# Altium project MB1936.PrjPcb (part 5 of 8)

## Sheet 2_DDR4_16bits.SchDoc: 2 DDR4 16 bits
size A3; Date: Not used; ApprovedBy: Not used; CheckedBy: Not used; Author: Not used; CompanyName: STMicroelectronics; DrawnBy: Not used; Engineer: Not used; Organization: Not used; Address1: Not used; Address2: Not used; Address3: Not used; Address4: Not used; DocumentNumber: Not used; Revision: Not used; SheetNumber: 6; SheetTotal: 18; CurrentTime: Not used; CurrentDate: Not used; Time: Not used; DocumentFullPathAndName: Not used; DocumentName: Not used; ModifiedDate: Not used; ImagePath: Not used; ProjectName: Not used; Application_BuildNumber: Not used
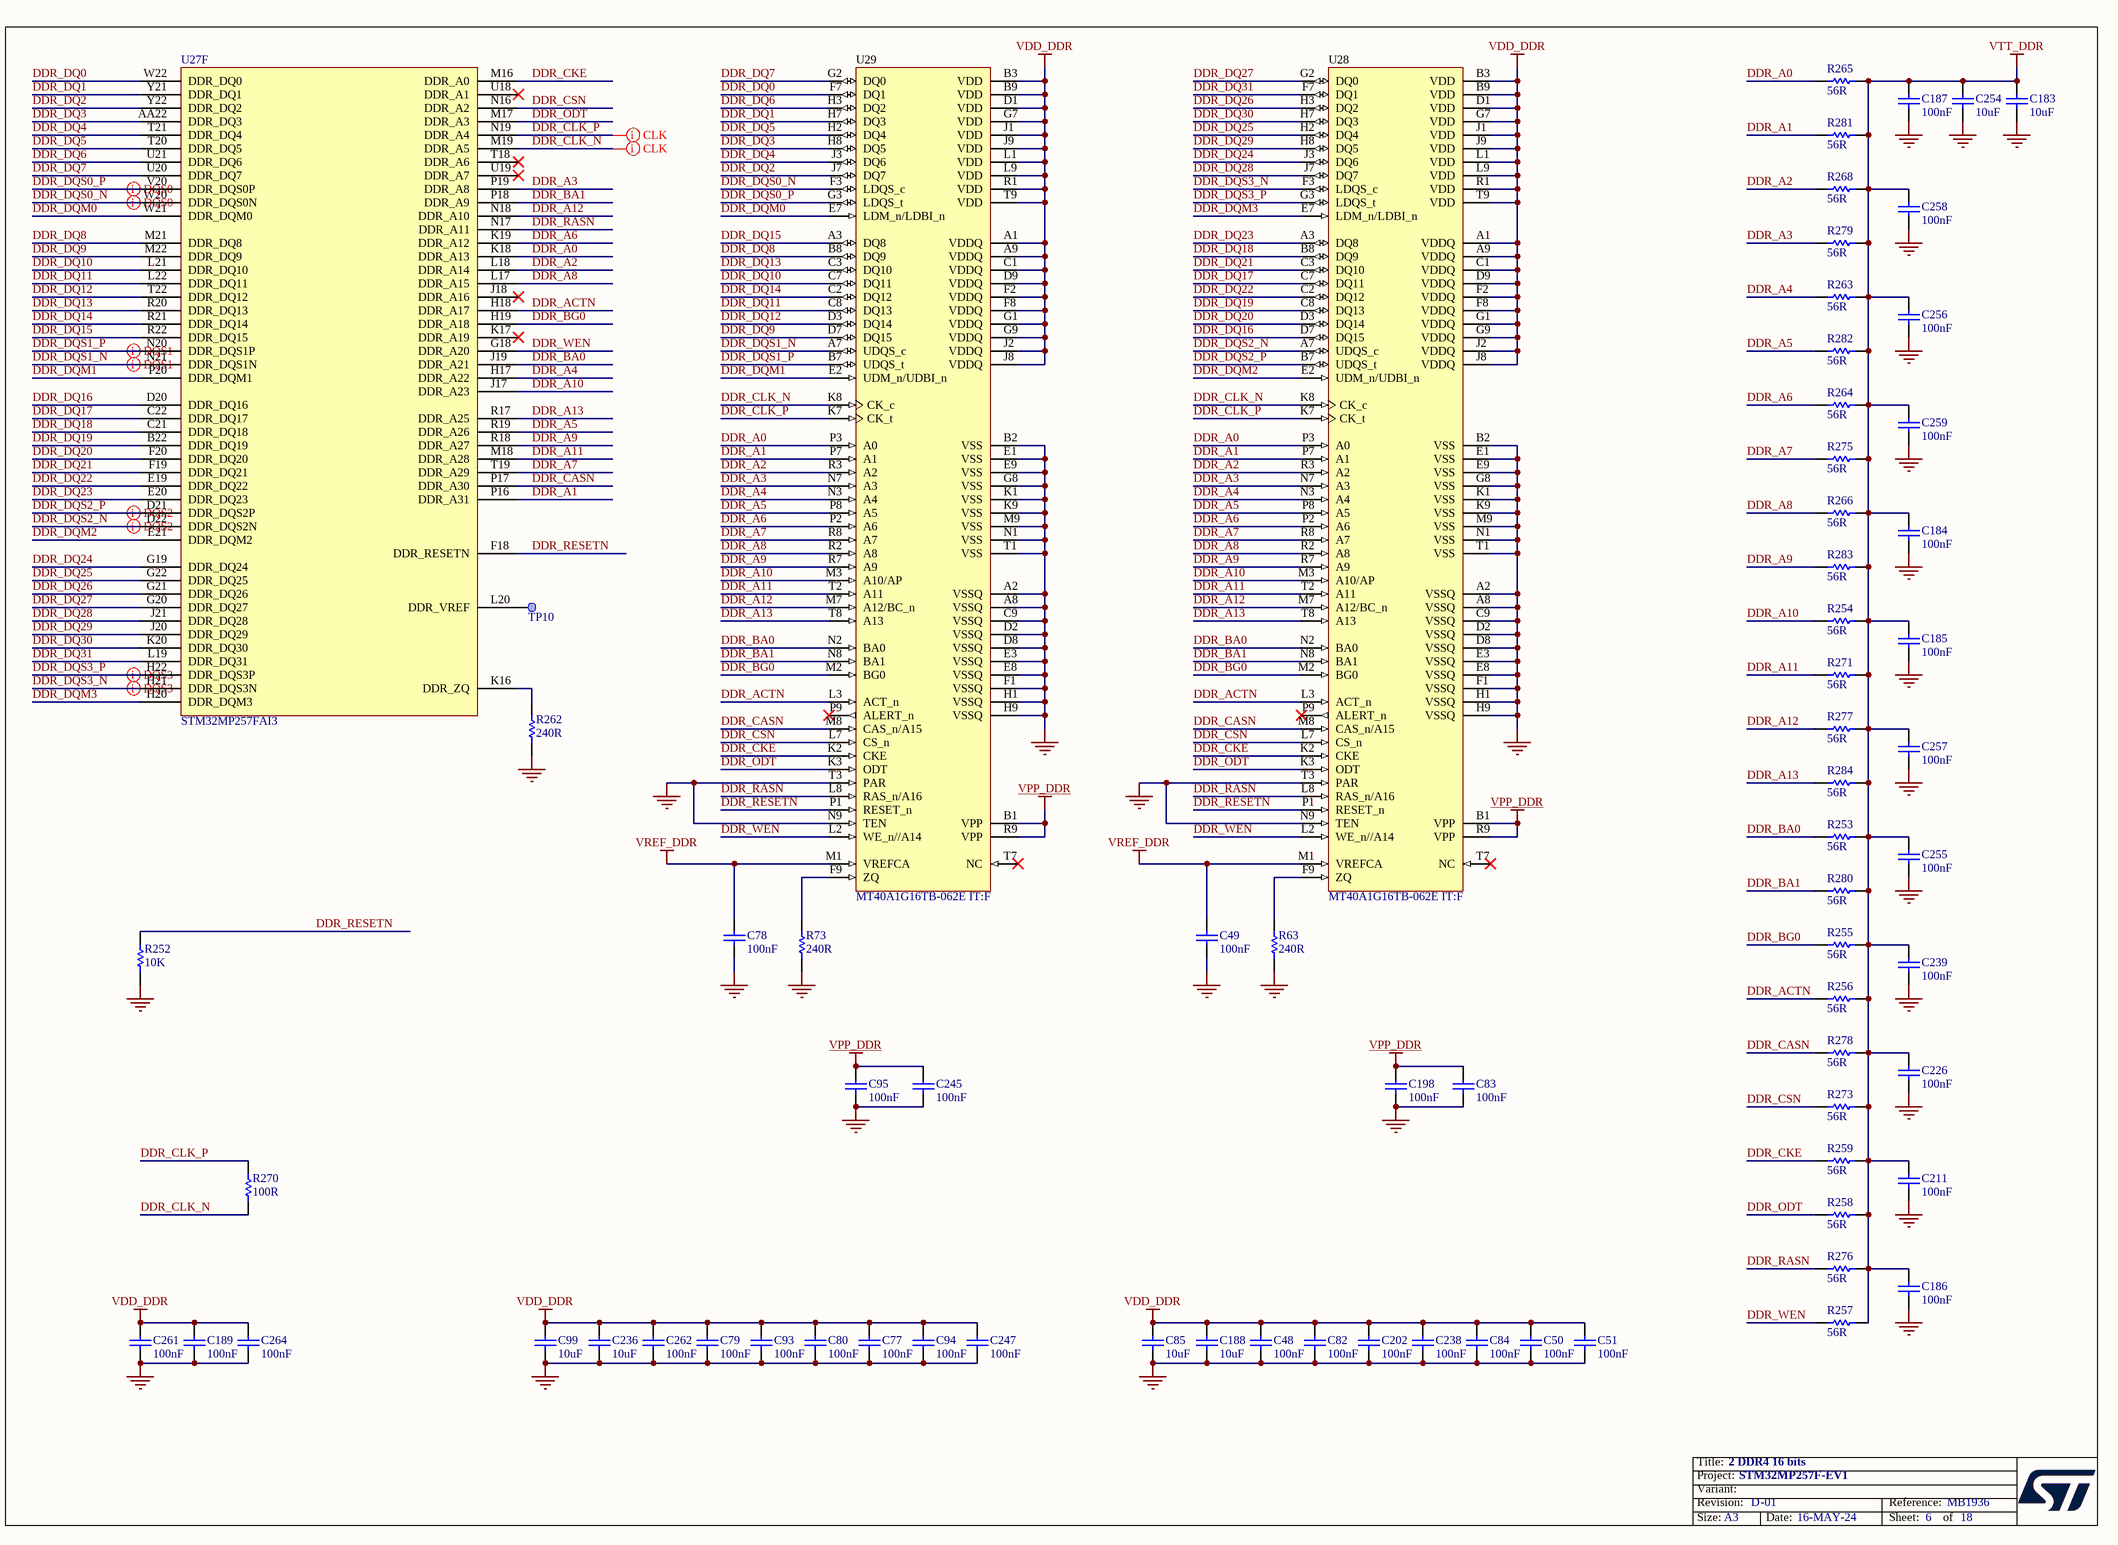
[diagram p13: 2_DDR4_16bits.SchDoc]

### Parts
C48  value 100nF  [C0402]  (hidden comment: Capacitor)
C49  value 100nF  [C0402]  (hidden comment: Capacitor)
C50  value 100nF  [C0402]  (hidden comment: Capacitor)
C51  value 100nF  [C0402]  (hidden comment: Capacitor)
C77  value 100nF  [C0402]  (hidden comment: Capacitor)
C78  value 100nF  [C0402]  (hidden comment: Capacitor)
C79  value 100nF  [C0402]  (hidden comment: Capacitor)
C80  value 100nF  [C0402]  (hidden comment: Capacitor)
C82  value 100nF  [C0402]  (hidden comment: Capacitor)
C83  value 100nF  [C0402]  (hidden comment: Capacitor)
C84  value 100nF  [C0402]  (hidden comment: Capacitor)
C85  value 10uF  [C0603]  (hidden comment: Capacitor)
C93  value 100nF  [C0402]  (hidden comment: Capacitor)
C94  value 100nF  [C0402]  (hidden comment: Capacitor)
C95  value 100nF  [C0402]  (hidden comment: Capacitor)
C99  value 10uF  [C0603]  (hidden comment: Capacitor)
C183  value 10uF  [C0603]  (hidden comment: Capacitor)
C184  value 100nF  [C0402]  (hidden comment: Capacitor)
C185  value 100nF  [C0402]  (hidden comment: Capacitor)
C186  value 100nF  [C0402]  (hidden comment: Capacitor)
C187  value 100nF  [C0402]  (hidden comment: Capacitor)
C188  value 10uF  [C0603]  (hidden comment: Capacitor)
C189  value 100nF  [C0402]  (hidden comment: Capacitor)
C198  value 100nF  [C0402]  (hidden comment: Capacitor)
C202  value 100nF  [C0402]  (hidden comment: Capacitor)
C211  value 100nF  [C0402]  (hidden comment: Capacitor)
C226  value 100nF  [C0402]  (hidden comment: Capacitor)
C236  value 10uF  [C0603]  (hidden comment: Capacitor)
C238  value 100nF  [C0402]  (hidden comment: Capacitor)
C239  value 100nF  [C0402]  (hidden comment: Capacitor)
C245  value 100nF  [C0402]  (hidden comment: Capacitor)
C247  value 100nF  [C0402]  (hidden comment: Capacitor)
C254  value 10uF  [C0603]  (hidden comment: Capacitor)
C255  value 100nF  [C0402]  (hidden comment: Capacitor)
C256  value 100nF  [C0402]  (hidden comment: Capacitor)
C257  value 100nF  [C0402]  (hidden comment: Capacitor)
C258  value 100nF  [C0402]  (hidden comment: Capacitor)
C259  value 100nF  [C0402]  (hidden comment: Capacitor)
C261  value 100nF  [C0402]  (hidden comment: Capacitor)
C262  value 100nF  [C0402]  (hidden comment: Capacitor)
C264  value 100nF  [C0402]  (hidden comment: Capacitor)
R63  value 240R  [R0201_H0P23]  (hidden comment: Resistor)
R73  value 240R  [R0201_H0P23]  (hidden comment: Resistor)
R252  value 10K  [R0402]  (hidden comment: Resistor)
R253  value 56R  [R0402]  (hidden comment: Resistor)
R254  value 56R  [R0402]  (hidden comment: Resistor)
R255  value 56R  [R0402]  (hidden comment: Resistor)
R256  value 56R  [R0402]  (hidden comment: Resistor)
R257  value 56R  [R0402]  (hidden comment: Resistor)
R258  value 56R  [R0402]  (hidden comment: Resistor)
R259  value 56R  [R0402]  (hidden comment: Resistor)
R262  value 240R  [R0201_H0P23]  (hidden comment: Resistor)
R263  value 56R  [R0402]  (hidden comment: Resistor)
R264  value 56R  [R0402]  (hidden comment: Resistor)
R265  value 56R  [R0402]  (hidden comment: Resistor)
R266  value 56R  [R0402]  (hidden comment: Resistor)
R268  value 56R  [R0402]  (hidden comment: Resistor)
R270  value 100R  [R0402]  (hidden comment: Resistor)
R271  value 56R  [R0402]  (hidden comment: Resistor)
R273  value 56R  [R0402]  (hidden comment: Resistor)
R275  value 56R  [R0402]  (hidden comment: Resistor)
R276  value 56R  [R0402]  (hidden comment: Resistor)
R277  value 56R  [R0402]  (hidden comment: Resistor)
R278  value 56R  [R0402]  (hidden comment: Resistor)
R279  value 56R  [R0402]  (hidden comment: Resistor)
R280  value 56R  [R0402]  (hidden comment: Resistor)
R281  value 56R  [R0402]  (hidden comment: Resistor)
R282  value 56R  [R0402]  (hidden comment: Resistor)
R283  value 56R  [R0402]  (hidden comment: Resistor)
R284  value 56R  [R0402]  (hidden comment: Resistor)
TP10  Test Point  [TP_SMD_0-6MM]  (value not drawn)  (no BOM)
U27  STM32MP257FAI3  [ICC_LFBGA436_18X18_P080_H1P70_STM32MP257_CODE-B0D1]  (part F of 9)
U28  MT40A1G16TB-062E IT:F  [ICC_FBGA96_TB_7P5X13_P080]
U29  MT40A1G16TB-062E IT:F  [ICC_FBGA96_TB_7P5X13_P080]

### Nets
GND: C48.1 C49.1 C50.1 C51.1 C77.1 C78.1 C79.1 C80.1 C82.1 C83.1 C84.1 C85.1 C93.1 C94.1 C95.1 C99.1 C183.1 C184.1 C185.1 C186.1 C187.1 C188.1 C189.1 C198.1 C202.1 C211.1 C226.1 C236.1 C238.1 C239.1 C245.1 C247.1 C254.1 C255.1 C256.1 C257.1 C258.1 C259.1 C261.1 C262.1 C264.1 R63.1 R73.1 R252.1 R262.1 U28.A2(VSSQ) U28.A8(VSSQ) U28.B2(VSS) U28.C9(VSSQ) U28.D2(VSSQ) U28.D8(VSSQ) U28.E1(VSS) U28.E3(VSSQ) U28.E8(VSSQ) U28.E9(VSS) U28.F1(VSSQ) U28.G8(VSS) U28.H1(VSSQ) U28.H9(VSSQ) U28.K1(VSS) U28.K9(VSS) U28.M9(VSS) U28.N1(VSS) U28.N9(TEN) U28.T1(VSS) U28.T3(PAR) U29.A2(VSSQ) U29.A8(VSSQ) U29.B2(VSS) U29.C9(VSSQ) U29.D2(VSSQ) U29.D8(VSSQ) U29.E1(VSS) U29.E3(VSSQ) U29.E8(VSSQ) U29.E9(VSS) U29.F1(VSSQ) U29.G8(VSS) U29.H1(VSSQ) U29.H9(VSSQ) U29.K1(VSS) U29.K9(VSS) U29.M9(VSS) U29.N1(VSS) U29.N9(TEN) U29.T1(VSS) U29.T3(PAR)
VDD_DDR: C48.2 C50.2 C51.2 C77.2 C79.2 C80.2 C82.2 C84.2 C85.2 C93.2 C94.2 C99.2 C188.2 C189.2 C202.2 C236.2 C238.2 C247.2 C261.2 C262.2 C264.2 U28.A1(VDDQ) U28.A9(VDDQ) U28.B3(VDD) U28.B9(VDD) U28.C1(VDDQ) U28.D1(VDD) U28.D9(VDDQ) U28.F2(VDDQ) U28.F8(VDDQ) U28.G1(VDDQ) U28.G7(VDD) U28.G9(VDDQ) U28.J1(VDD) U28.J2(VDDQ) U28.J8(VDDQ) U28.J9(VDD) U28.L1(VDD) U28.L9(VDD) U28.R1(VDD) U28.T9(VDD) U29.A1(VDDQ) U29.A9(VDDQ) U29.B3(VDD) U29.B9(VDD) U29.C1(VDDQ) U29.D1(VDD) U29.D9(VDDQ) U29.F2(VDDQ) U29.F8(VDDQ) U29.G1(VDDQ) U29.G7(VDD) U29.G9(VDDQ) U29.J1(VDD) U29.J2(VDDQ) U29.J8(VDDQ) U29.J9(VDD) U29.L1(VDD) U29.L9(VDD) U29.R1(VDD) U29.T9(VDD)
VPP_DDR: C83.2 C95.2 C198.2 C245.2 U28.B1(VPP) U28.R9(VPP) U29.B1(VPP) U29.R9(VPP)
VREF_DDR: C49.2 C78.2 U28.M1(VREFCA) U29.M1(VREFCA)
VTT_DDR: C183.2 C184.2 C185.2 C186.2 C187.2 C211.2 C226.2 C239.2 C254.2 C255.2 C256.2 C257.2 C258.2 C259.2 R253.2 R254.2 R255.2 R256.2 R257.2 R258.2 R259.2 R263.2 R264.2 R265.2 R266.2 R268.2 R271.2 R273.2 R275.2 R276.2 R277.2 R278.2 R279.2 R280.2 R281.2 R282.2 R283.2 R284.2
DDR_A0: R265.1 U27.K18(DDR_A13) U28.P3(A0) U29.P3(A0)
DDR_A1: R281.1 U27.P16(DDR_A31) U28.P7(A1) U29.P7(A1)
DDR_A2: R268.1 U27.L18(DDR_A14) U28.R3(A2) U29.R3(A2)
DDR_A3: R279.1 U27.P19(DDR_A8) U28.N7(A3) U29.N7(A3)
DDR_A4: R263.1 U27.H17(DDR_A22) U28.N3(A4) U29.N3(A4)
DDR_A5: R282.1 U27.R19(DDR_A26) U28.P8(A5) U29.P8(A5)
DDR_A6: R264.1 U27.K19(DDR_A12) U28.P2(A6) U29.P2(A6)
DDR_A7: R275.1 U27.T19(DDR_A29) U28.R8(A7) U29.R8(A7)
DDR_A8: R266.1 U27.L17(DDR_A15) U28.R2(A8) U29.R2(A8)
DDR_A9: R283.1 U27.R18(DDR_A27) U28.R7(A9) U29.R7(A9)
DDR_A10: R254.1 U27.J17(DDR_A23) U28.M3(A10/AP) U29.M3(A10/AP)
DDR_A11: R271.1 U27.M18(DDR_A28) U28.T2(A11) U29.T2(A11)
DDR_A12: R277.1 U27.N18(DDR_A10) U28.M7(A12/BC_n) U29.M7(A12/BC_n)
DDR_A13: R284.1 U27.R17(DDR_A25) U28.T8(A13) U29.T8(A13)
DDR_ACTN: R256.1 U27.H18(DDR_A17) U28.L3(ACT_n) U29.L3(ACT_n)
DDR_BA0: R253.1 U27.J19(DDR_A21) U28.N2(BA0) U29.N2(BA0)
DDR_BA1: R280.1 U27.P18(DDR_A9) U28.N8(BA1) U29.N8(BA1)
DDR_BG0: R255.1 U27.H19(DDR_A18) U28.M2(BG0) U29.M2(BG0)
DDR_CASN: R278.1 U27.P17(DDR_A30) U28.M8(CAS_n/A15) U29.M8(CAS_n/A15)
DDR_CKE: R259.1 U27.M16(DDR_A0) U28.K2(CKE) U29.K2(CKE)
DDR_CLK_N: R270.2 U27.M19(DDR_A5) U28.K8(CK_c) U29.K8(CK_c)
DDR_CLK_P: R270.1 U27.N19(DDR_A4) U28.K7(CK_t) U29.K7(CK_t)
DDR_CSN: R273.1 U27.N16(DDR_A2) U28.L7(CS_n) U29.L7(CS_n)
DDR_DQ0: U27.W22(DDR_DQ0) U29.F7(DQ1)
DDR_DQ1: U27.Y21(DDR_DQ1) U29.H7(DQ3)
DDR_DQ2: U27.Y22(DDR_DQ2) U29.J7(DQ7)
DDR_DQ3: U27.AA22(DDR_DQ3) U29.H8(DQ5)
DDR_DQ4: U27.T21(DDR_DQ4) U29.J3(DQ6)
DDR_DQ5: U27.T20(DDR_DQ5) U29.H2(DQ4)
DDR_DQ6: U27.U21(DDR_DQ6) U29.H3(DQ2)
DDR_DQ7: U27.U20(DDR_DQ7) U29.G2(DQ0)
DDR_DQ8: U27.M21(DDR_DQ8) U29.B8(DQ9)
DDR_DQ9: U27.M22(DDR_DQ9) U29.D7(DQ15)
DDR_DQ10: U27.L21(DDR_DQ10) U29.C7(DQ11)
DDR_DQ11: U27.L22(DDR_DQ11) U29.C8(DQ13)
DDR_DQ12: U27.T22(DDR_DQ12) U29.D3(DQ14)
DDR_DQ13: U27.R20(DDR_DQ13) U29.C3(DQ10)
DDR_DQ14: U27.R21(DDR_DQ14) U29.C2(DQ12)
DDR_DQ15: U27.R22(DDR_DQ15) U29.A3(DQ8)
DDR_DQ16: U27.D20(DDR_DQ16) U28.D7(DQ15)
DDR_DQ17: U27.C22(DDR_DQ17) U28.C7(DQ11)
DDR_DQ18: U27.C21(DDR_DQ18) U28.B8(DQ9)
DDR_DQ19: U27.B22(DDR_DQ19) U28.C8(DQ13)
DDR_DQ20: U27.F20(DDR_DQ20) U28.D3(DQ14)
DDR_DQ21: U27.F19(DDR_DQ21) U28.C3(DQ10)
DDR_DQ22: U27.E19(DDR_DQ22) U28.C2(DQ12)
DDR_DQ23: U27.E20(DDR_DQ23) U28.A3(DQ8)
DDR_DQ24: U27.G19(DDR_DQ24) U28.J3(DQ6)
DDR_DQ25: U27.G22(DDR_DQ25) U28.H2(DQ4)
DDR_DQ26: U27.G21(DDR_DQ26) U28.H3(DQ2)
DDR_DQ27: U27.G20(DDR_DQ27) U28.G2(DQ0)
DDR_DQ28: U27.J21(DDR_DQ28) U28.J7(DQ7)
DDR_DQ29: U27.J20(DDR_DQ29) U28.H8(DQ5)
DDR_DQ30: U27.K20(DDR_DQ30) U28.H7(DQ3)
DDR_DQ31: U27.L19(DDR_DQ31) U28.F7(DQ1)
DDR_DQM0: U27.W21(DDR_DQM0) U29.E7(LDM_n/LDBI_n)
DDR_DQM1: U27.P20(DDR_DQM1) U29.E2(UDM_n/UDBI_n)
DDR_DQM2: U27.E21(DDR_DQM2) U28.E2(UDM_n/UDBI_n)
DDR_DQM3: U27.H20(DDR_DQM3) U28.E7(LDM_n/LDBI_n)
DDR_DQS0_N: U27.W20(DDR_DQS0N) U29.F3(LDQS_c)
DDR_DQS0_P: U27.V20(DDR_DQS0P) U29.G3(LDQS_t)
DDR_DQS1_N: U27.N21(DDR_DQS1N) U29.A7(UDQS_c)
DDR_DQS1_P: U27.N20(DDR_DQS1P) U29.B7(UDQS_t)
DDR_DQS2_N: U27.D22(DDR_DQS2N) U28.A7(UDQS_c)
DDR_DQS2_P: U27.D21(DDR_DQS2P) U28.B7(UDQS_t)
DDR_DQS3_N: U27.H21(DDR_DQS3N) U28.F3(LDQS_c)
DDR_DQS3_P: U27.H22(DDR_DQS3P) U28.G3(LDQS_t)
DDR_ODT: R258.1 U27.M17(DDR_A3) U28.K3(ODT) U29.K3(ODT)
DDR_RASN: R276.1 U27.N17(DDR_A11) U28.L8(RAS_n/A16) U29.L8(RAS_n/A16)
DDR_RESETN: R252.2 U27.F18(DDR_RESETN) U28.P1(RESET_n) U29.P1(RESET_n)
DDR_WEN: R257.1 U27.G18(DDR_A20) U28.L2(WE_n//A14) U29.L2(WE_n//A14)
NetR63_2: R63.2 U28.F9(ZQ)
NetR73_2: R73.2 U29.F9(ZQ)
NetR262_2: R262.2 U27.K16(DDR_ZQ)
NetTP10_1: TP10.1 U27.L20(DDR_VREF)

Not connected (* = marked no-connect by the designer): U27 J18(DDR_A16)* K17(DDR_A19)* T18(DDR_A6)* U18(DDR_A1)* U19(DDR_A7)*; U28 P9(ALERT_n)* T7(NC)*; U29 P9(ALERT_n)* T7(NC)*

### Layout directives
differential pair: DDR_CLK_N, DDR_CLK_P, DDR_DQS0_N, DDR_DQS0_P, DDR_DQS1_N, DDR_DQS1_P, DDR_DQS2_N, DDR_DQS2_P, DDR_DQS3_N, DDR_DQS3_P

### Notes on the sheet
- Title:
- Project:
- Size:
- Revision:
- Variant:
- A3
- -
- Date:
- Reference:
- Sheet:
- of

### Library data of the parts
C48-C51 C77-C80 C82-C84 C93-C95 C184-C187 C189 C198 C202 C211 C226 C238 C239 C245 C247 C255-C259 C261 C262 C264 = MCD-00006: Capacitor, MLCC, 100nF, 16V, X7R, +/-10%, 0402, T=0.5mm; Part_Preference: Recommended; Manufacturer: YAGEO; Manufacturer_Part_Number: CC0402KRX7R7BB104; Alternate_Manufacturer: MURATA; Alternate_Manufacturer_Part_Number: GCM155R71C104KA55D; Order_Code_RS: 616-9701; Internal_Part_Number: MCD-00006; Status: Released; Part_Type: Capacitor; Package: 0402; ComponentLink1Description: Datasheet; ComponentLink1URL: http://tunmcdsvn.tun.st.com/Component_Documentation_Library/Trunk/Capacitor/YAGEO_X7R_Series; Order_Code_Digikey: 311-1338-1-ND; Order_Code_Farnell: 9402047
C85 C99 C188 C236 = MCD-01341: Capacitor, MLCC, 10uF, 6V3, X5R, +/-20%, 0603, T=0,8mm; Part_Preference: Recommended; Manufacturer: MURATA; Manufacturer_Part_Number: GRM188R60J106ME47D; Alternate_Manufacturer_Part_Number: GRM188R60J106ME84D; Internal_Part_Number: MCD-01341; Status: Released; Part_Type: Capacitor; Alternate_Manufacturer: MURATA; Package: 0603; ComponentLink1URL: http://tunmcdsvn.tun.st.com/Component_Documentation_Library/Trunk/Capacitor/MURATA_GRM_Series; Order_Code_Digikey: 490-3896-1-ND; Order_Code_Farnell: 1735528; Order_Code_RS: N/A
C183 C254 = MCD-00099: Capacitor, MLCC, 10uF, 10V, X5R, +/-10%, 0603, T=0.8mm; Part_Preference: Recommended; Manufacturer: MURATA; Manufacturer_Part_Number: GRM188R61A106KE69D; Partial_Alternate_Internal_Part_Number: MCD-03152; Order_Code_RS: 2494233; Component_Country_Of_Origin: Japan°°; ShowFields: YES; ID: 2770; Internal_Part_Number: MCD-00099; Status: Released; Part_Type: Capacitor; Package: 0603; ComponentLink1URL: http://tunmcdsvn.tun.st.com/Component_Documentation_Library/Trunk/Capacitor/MURATA_GRM_Series; Order_Code_Digikey: 490-10474-1-ND; Order_Code_Farnell: 2494233
R63 R73 R262 = MCD-02253: Resistor,240R,0201,1%,1/20W; Part_Preference: Recommended; Manufacturer: YAGEO; Manufacturer_Part_Number: RC0201FR-07240RL; Internal_Part_Number: MCD-02253; Status: Checked; Part_Type: Resistor; Alternate_Manufacturer: N/A; Alternate_Manufacturer_Part_Number: N/A; Package: R0201; ComponentLink1URL: http://tunmcdsvn.tun.st.com/Component_Datasheet_Library/Trunk/Resistors/Yageo_Resistor_RC0201-series; Order_Code_Digikey: YAG2528CT-ND; Order_Code_Farnell: N/A; Order_Code_RS: N/A
R252 = MCD-00053: Resistor,10K,0402,1%,1/16W; BMS_Part_Number: 9131590; Part_Preference: Recommended; Manufacturer: YAGEO; Manufacturer_Part_Number: RC0402FR-0710KL; Internal_Part_Number: MCD-00053; Status: Released; Part_Type: Resistor; Package: 0402; ComponentLink1Description: Datasheet; ComponentLink1URL: http://tunmcdsvn.tun.st.com/Component_Documentation_Library/Trunk/Resistor/YAGEO_RC_L_Series; Order_Code_Digikey: 311-10.0KLRCT-ND; Order_Code_Farnell: 9239359; Order_Code_RS: N/A; Alternate_Manufacturer: N/A; Alternate_Manufacturer_Part_Number: N/A
R253-R259 R263-R266 R268 R271 R273 R275-R284 = MCD-00054: Resistor, 56R, 0402, +/-1%, 1/16W; Part_Preference: Recommended; Manufacturer: YAGEO; Manufacturer_Part_Number: RC0402FR-0756RL; Internal_Part_Number: MCD-00054; Status: Released; Part_Type: Resistor; Package: 0402; ComponentLink1URL: http://tunmcdsvn.tun.st.com/Component_Documentation_Library/Trunk/Resistor/YAGEO_RC_L_Series; Order_Code_Digikey: 311-56.0LRCT-ND; Order_Code_Farnell: 9239081; Order_Code_RS: N/A; Alternate_Manufacturer: N/A; Alternate_Manufacturer_Part_Number: N/A
R270 = MCD-01819: Resistor,100R,0402,0,5%,1/16W,±100ppm/°C; Part_Preference: Recommended; Manufacturer: YAGEO; Manufacturer_Part_Number: RC0402DR-07100RL; Internal_Part_Number: MCD-01819; Status: Released; Part_Type: Resistor; Package: 0402; ComponentLink1Description: Datasheet; ComponentLink1URL: http://tunmcdsvn.tun.st.com/Component_Documentation_Library/Trunk/Resistor/YAGEO_RC_L_Series; Order_Code_Digikey: RC0402DR-07100RL-ND; Order_Code_Farnell: N/A; Order_Code_RS: N/A; Alternate_Manufacturer: N/A; Alternate_Manufacturer_Part_Number: N/A
TP10 = MCD-00631: Test Point 0.6mm; Part_Type: Misc; Part_Preference: Recommended; Internal_Part_Number: MCD-00631; Status: Released; Manufacturer: N/A; Manufacturer_Part_Number: N/A
U27 = MCD-02000: as U27 on sheet Power_MPU; Internal_Part_Number: MCD-02000; Value: STM32MP257FAI3; Status: Checked; Manufacturer_Part_Number: STM32MP257FAI3; Package: LFBGA-436; ComponentLink1URL: http://tunmcdsvn.tun.st.com/Component_Documentation_Library/Trunk/IC/STMICROELECTRONICS_STM32MP257FAI3; Order_Code_Digikey: N/A; Order_Code_Farnell: N/A; Order_Code_RS: N/A
U28 U29 = MCD-03523: Memory, DDR4 SDRAM, 1V2, 16Gbit, FBGA96; Part_Type: IC; Part_Preference: Recommended; Manufacturer: MICRON; Component_Country_Of_Origin: Taiwan°; ShowFields: YES; ID: 5639; Internal_Part_Number: MCD-03523; Value: MT40A1G16TB-062E IT:F; Status: New; Manufacturer_Part_Number: MT40A1G16TB-062E IT:F; Package: FBGA-96; ComponentLink1URL: http://tunmcdsvn.tun.st.com/Component_Documentation_Library/Trunk/IC/MICRON_MT40A1G16TB-062E-IT-F; Order_Code_Digikey: N/A; Order_Code_Farnell: N/A; Order_Code_RS: N/A

## Sheet USB_PCIe.SchDoc: USB_PCIe
size A3; Date: Not used; ApprovedBy: Not used; CheckedBy: Not used; Author: Not used; CompanyName: STMicroelectronics; DrawnBy: Not used; Engineer: Not used; Organization: Not used; Address1: Not used; Address2: Not used; Address3: Not used; Address4: Not used; DocumentNumber: Not used; Revision: Not used; SheetNumber: 11; SheetTotal: 18; CurrentTime: Not used; CurrentDate: Not used; Time: Not used; DocumentFullPathAndName: Not used; DocumentName: Not used; ModifiedDate: Not used; ImagePath: Not used; ProjectName: Not used; Application_BuildNumber: Not used
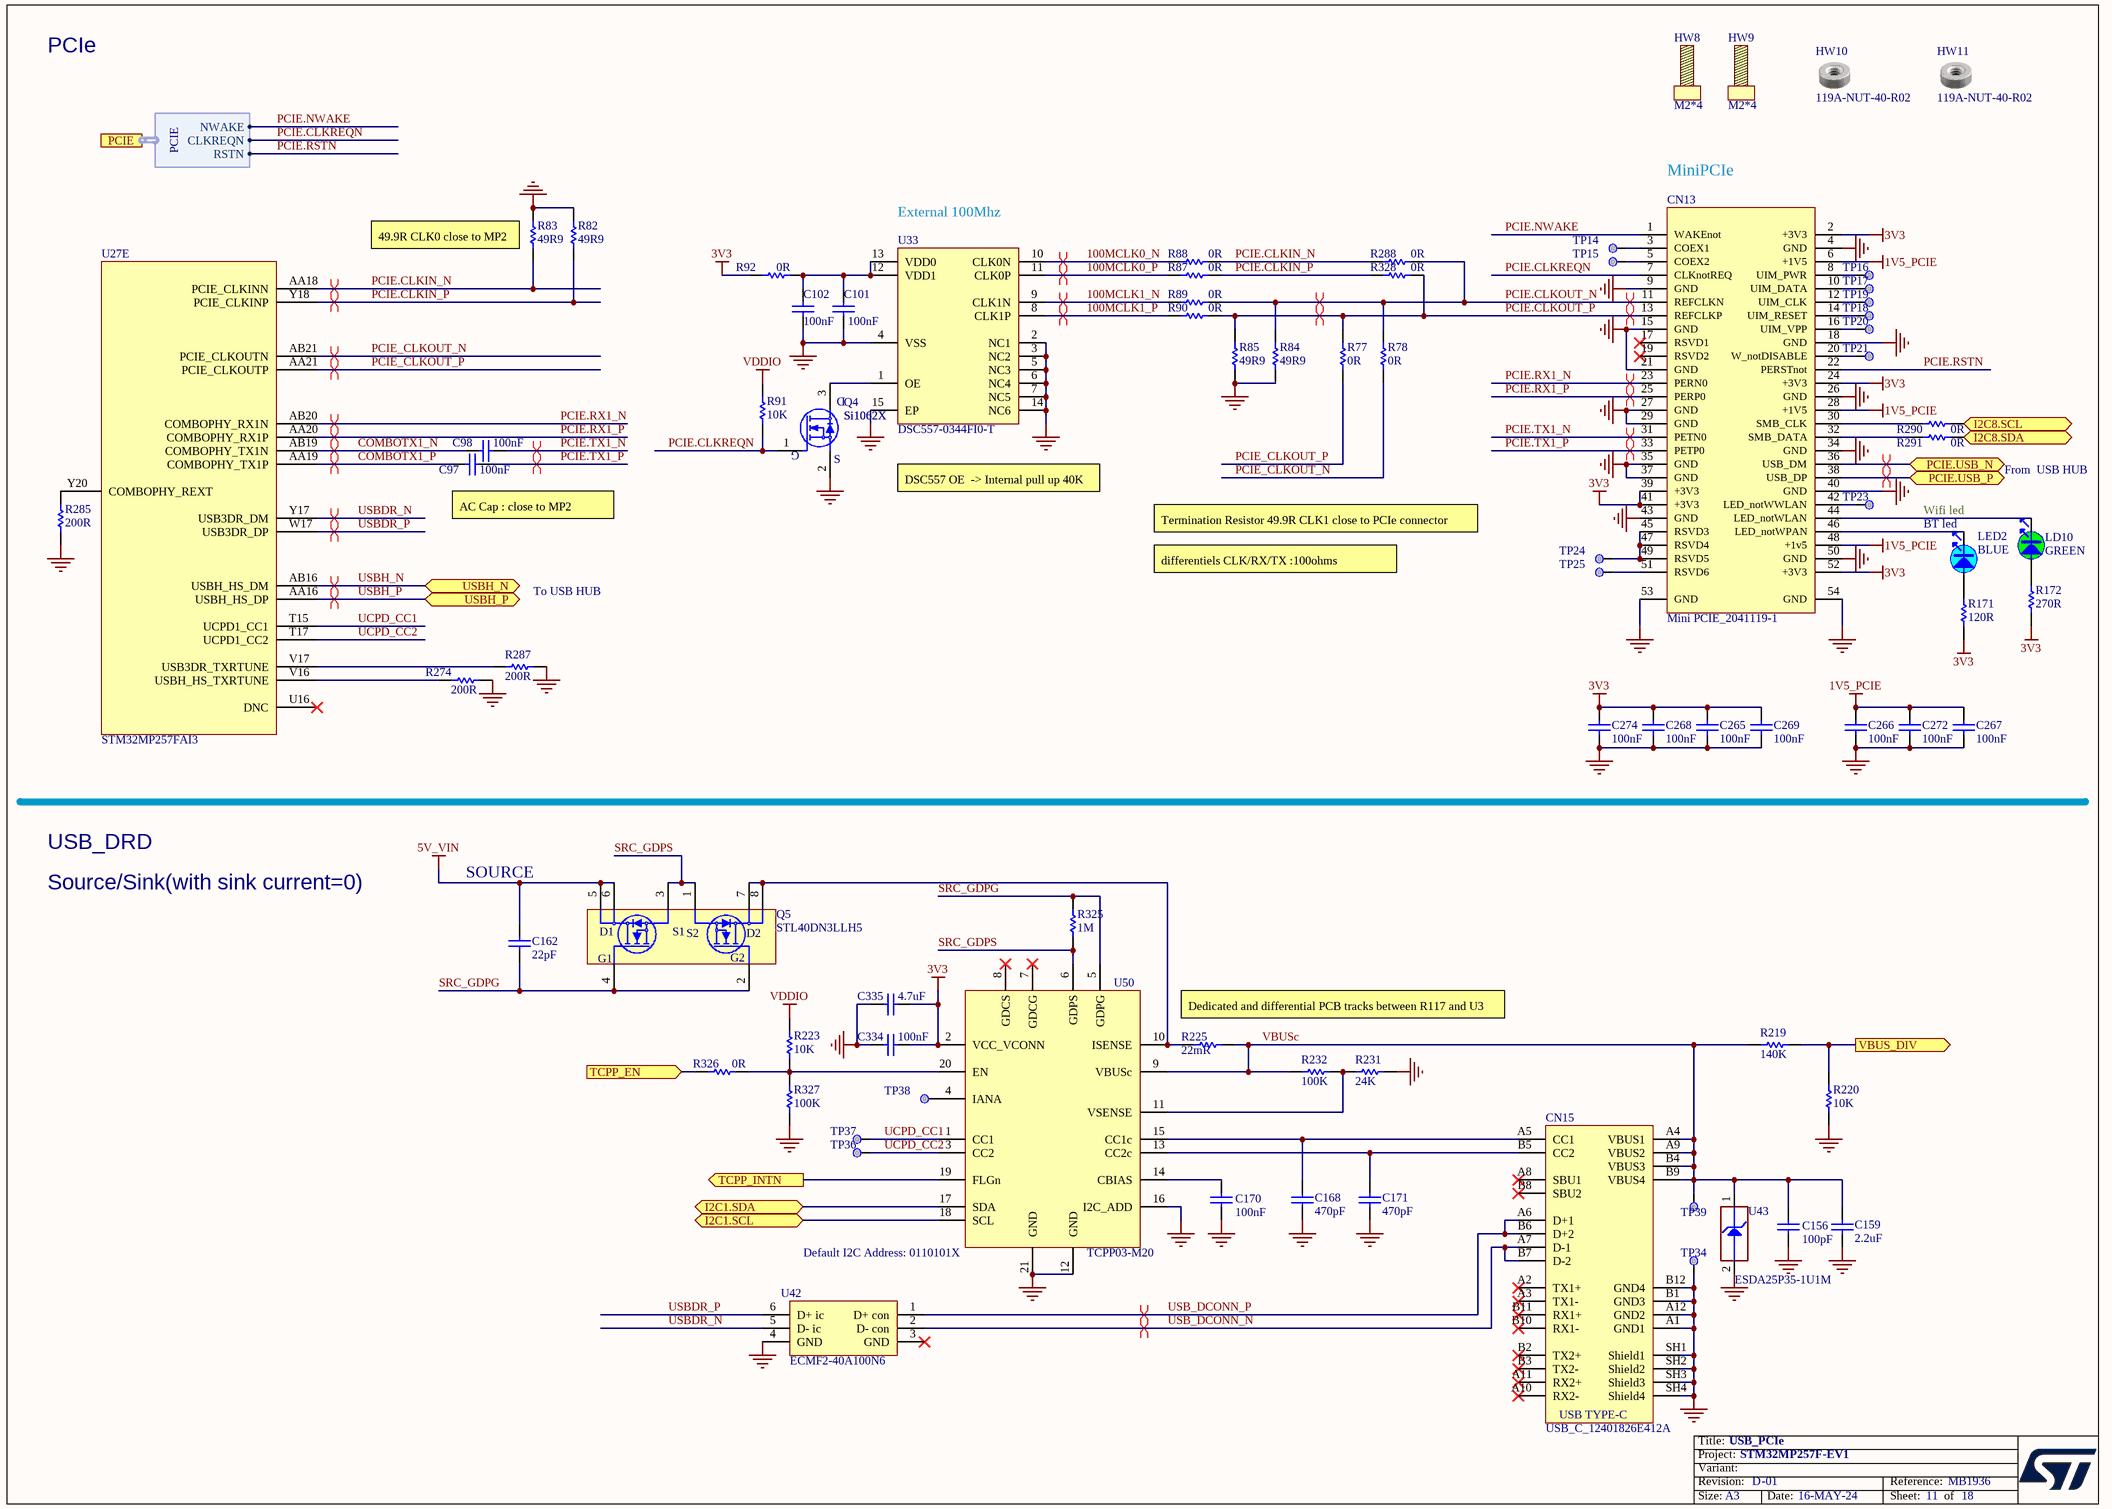
[diagram p14: USB_PCIe.SchDoc]

### Parts
C97  value 100nF  [C0201_MURATA_GRM033_H0P3]  (hidden comment: Capacitor)
C98  value 100nF  [C0201_MURATA_GRM033_H0P3]  (hidden comment: Capacitor)
C101  value 100nF  [C0402]  (hidden comment: Capacitor)
C102  value 100nF  [C0402]  (hidden comment: Capacitor)
C156  value 100pF  [C0402]  (hidden comment: Capacitor)
C159  value 2.2uF  [C0805]  (hidden comment: Capacitor)
C162  value 22pF  [C0402]  (hidden comment: Capacitor)
C168  value 470pF  [C0402]  (hidden comment: Capacitor)
C170  value 100nF  [C0603]  (hidden comment: Capacitor)
C171  value 470pF  [C0402]  (hidden comment: Capacitor)
C265  value 100nF  [C0201_H0P3]  (hidden comment: Capacitor)
C266  value 100nF  [C0201_H0P3]  (hidden comment: Capacitor)
C267  value 100nF  [C0201_H0P3]  (hidden comment: Capacitor)
C268  value 100nF  [C0201_H0P3]  (hidden comment: Capacitor)
C269  value 100nF  [C0201_H0P3]  (hidden comment: Capacitor)
C272  value 100nF  [C0201_H0P3]  (hidden comment: Capacitor)
C274  value 100nF  [C0201_H0P3]  (hidden comment: Capacitor)
C334  value 100nF  [C0402]  (hidden comment: Capacitor)
C335  value 4.7uF  [C0402]  (hidden comment: Capacitor)
CN13  value Mini PCIE_2041119-1  [CON_TE-CONNECTIVITY_2041119-1_HALF-CARD]  (hidden comment: SOCKET_Mini_PCIE)
CN15  value USB_C_12401826E412A  [CON_USB-TYPEC_AMPHENOL_12401826E412A]  (hidden comment: USB_TYPE_C_Receptacle)
HW8  value M2*4  (hidden comment: SCREW)  (mechanical)
HW9  value M2*4  (hidden comment: SCREW)  (mechanical)
HW10  value 119A-NUT-40-R02  [MISC_119A-NUT-40-R02]  (hidden comment: Standoff_mini_PCIE)  (mechanical)
HW11  value 119A-NUT-40-R02  [MISC_119A-NUT-40-R02]  (hidden comment: Standoff_mini_PCIE)  (mechanical)
LD10  value GREEN  [LED_0603_OSRAM_LG-Q396-PS-35_GREEN_1A2K_H0P4]  (hidden comment: LED_green)
LED2  value BLUE  [LED_0603_OSRAM_LB-Q39G-L2OO-35-1_BLUE_1A2K_H0P4]
Q4  value Si1062X  Manufacturer_Part_Number: Si1062X  [MOS_SC89-3L]  (hidden comment: MOSFET_N-CHANNEL)
Q5  STL40DN3LLH5  [PowerFLAT_5x6]
R77  value 0R  [R0402]  (hidden comment: Resistor)
R78  value 0R  [R0402]  (hidden comment: Resistor)
R82  value 49R9  [R0402]  (hidden comment: Resistor)
R83  value 49R9  [R0402]  (hidden comment: Resistor)
R84  value 49R9  [R0402]  (hidden comment: Resistor)
R85  value 49R9  [R0402]  (hidden comment: Resistor)
R87  value 0R  [R0402]  (hidden comment: Resistor)
R88  value 0R  [R0402]  (hidden comment: Resistor)
R89  value 0R  [R0402]  (hidden comment: Resistor)
R90  value 0R  [R0402]  (hidden comment: Resistor)
R91  value 10K  [R0402]  (hidden comment: Resistor)
R92  value 0R  [R0402]  (hidden comment: Resistor)
R171  value 120R  [R0402]
R172  value 270R  [R0402]  (hidden comment: Resistor)
R219  value 140K  [R0402]  (hidden comment: Resistor)
R220  value 10K  [R0402]  (hidden comment: Resistor)
R223  value 10K  [R0402]  (hidden comment: Resistor)
R225  value 22mR  [R0603]  (hidden comment: Resistor)
R231  value 24K  [R0402]  (hidden comment: Resistor)
R232  value 100K  [R0402]  (hidden comment: Resistor)
R274  value 200R  [R0402]  (hidden comment: Resistor)
R285  value 200R  [R0402]  (hidden comment: Resistor)
R287  value 200R  [R0402]  (hidden comment: Resistor)
R288  value 0R  [R0402]  (hidden comment: Resistor)
R290  value 0R  [R0402]  (hidden comment: Resistor)
R291  value 0R  [R0402]  (hidden comment: Resistor)
R325  value 1M  [R0402]  (hidden comment: Resistor)
R326  value 0R  [R0402]  (hidden comment: Resistor)
R327  value 100K  [R0402]  (hidden comment: Resistor)
R328  value 0R  [R0402]  (hidden comment: Resistor)
TP14  Test Point  [TP_SMD_1MM]  (value not drawn)  (no BOM)
TP15  Test Point  [TP_SMD_1MM]  (value not drawn)  (no BOM)
TP16  Test Point  [TP_SMD_1MM]  (value not drawn)  (no BOM)
TP17  Test Point  [TP_SMD_1MM]  (value not drawn)  (no BOM)
TP18  Test Point  [TP_SMD_1MM]  (value not drawn)  (no BOM)
TP19  Test Point  [TP_SMD_1MM]  (value not drawn)  (no BOM)
TP20  Test Point  [TP_SMD_1MM]  (value not drawn)  (no BOM)
TP21  Test Point  [TP_SMD_1MM]  (value not drawn)  (no BOM)
TP23  Test Point  [TP_SMD_1MM]  (value not drawn)  (no BOM)
TP24  Test Point  [TP_SMD_1MM]  (value not drawn)  (no BOM)
TP25  Test Point  [TP_SMD_1MM]  (value not drawn)  (no BOM)
TP34  Test Point  [TP_SMD_1MM]  (value not drawn)  (no BOM)
TP36  Test Point  [TP_SMD_1MM]  (value not drawn)  (no BOM)
TP37  Test Point  [TP_SMD_1MM]  (value not drawn)  (no BOM)
TP38  Test Point  [TP_SMD_1MM]  (value not drawn)  (no BOM)
TP39  Test Point  [TP_SMD_1MM]  (value not drawn)  (no BOM)
U27  STM32MP257FAI3  [ICC_LFBGA436_18X18_P080_H1P70_STM32MP257_CODE-B0D1]  (part E of 9)
U33  DSC557-0344FI0-T  [ICC_QFN14-EPAD_3P2X2P5_P050]
U42  ECMF2-40A100N6  [ESD_UQFN-6L_1P45X1P4_P040]
U43  value ESDA25P35-1U1M  [ESD_QFN1610_2N_1K_2A]  (hidden comment: ESD-TRANSIL)
U50  TCPP03-M20  [ICC_QFN20-EPAD_4X4_P050]

### Ports
I2C1.SCL (bidir), I2C1.SDA (bidir), I2C8.SCL (bidir), I2C8.SDA (bidir), PCIE (harness PCIE), PCIE.USB_N (bidir), PCIE.USB_P (bidir), TCPP_EN (in), TCPP_INTN (out), USBH_N (bidir), USBH_P (bidir), VBUS_DIV (out)

### Harnesses
PCIE: NWAKE, CLKREQN, RSTN

### Nets
1V5_PCIE: C266.1 C267.1 C272.1 CN13.6(+1V5) CN13.28(+1V5) CN13.48(+1v5)
3V3: C265.1 C268.1 C269.2 C274.1 C334.1 C335.1 CN13.2(+3V3) CN13.24(+3V3) CN13.39(+3V3) CN13.41(+3V3) CN13.52(+3V3) R92.1 R171.2 R172.1 U50.2(VCC_VCONN)
5V_VIN: C162.2 Q5.5(D1) Q5.6(D1)
GND: C101.1 C102.1 C156.1 C159.1 C168.1 C170.1 C171.1 C265.2 C266.2 C267.2 C268.2 C269.1 C272.2 C274.2 C334.2 C335.2 CN13.4(GND) CN13.9(GND) CN13.15(GND) CN13.18(GND) CN13.21(GND) CN13.26(GND) CN13.27(GND) CN13.29(GND) CN13.34(GND) CN13.35(GND) CN13.37(GND) CN13.40(GND) CN13.43(GND) CN13.50(GND) CN13.53(GND) CN13.54(GND) CN15.A1(GND1) CN15.A12(GND2) CN15.B1(GND3) CN15.B12(GND4) CN15.SH1(Shield1) CN15.SH2(Shield2) CN15.SH3(Shield3) CN15.SH4(Shield4) Q4.2(S) R82.2 R83.2 R84.1 R85.1 R220.1 R231.2 R274.2 R285.1 R287.2 R327.1 TP34.1 U33.2(NC1) U33.3(NC2) U33.4(VSS) U33.5(NC3) U33.6(NC4) U33.7(NC5) U33.14(NC6) U33.15(EP) U42.4(GND) U43.2(GND) U50.12(GND) U50.16(I2C_ADD) U50.21(GND)
VDDIO: R91.2 R223.2
100MCLK0_N: R88.1 U33.10(CLK0N)
100MCLK0_P: R87.1 U33.11(CLK0P)
100MCLK1_N: R89.1 U33.9(CLK1N)
100MCLK1_P: R90.1 U33.8(CLK1P)
COMBOTX1_N: C98.1 U27.AB19(COMBOPHY_TX1N)
COMBOTX1_P: C97.1 U27.AA19(COMBOPHY_TX1P)
EXP_GPIO2: R291.2 ; port I2C8.SDA
EXP_GPIO3: R290.2 ; port I2C8.SCL
I2C1.SCL: U50.18(SCL) ; port I2C1.SCL
I2C1.SDA: U50.17(SDA) ; port I2C1.SDA
PCIE.CLKIN_N: R83.1 R88.2 R288.2 U27.AA18(PCIE_CLKINN)
PCIE.CLKIN_P: R82.1 R87.2 R328.2 U27.Y18(PCIE_CLKINP)
PCIE.CLKOUT_N: CN13.11(REFCLKN) R78.2 R84.2 R89.2 R288.1
PCIE.CLKOUT_P: CN13.13(REFCLKP) R77.2 R85.2 R90.2 R328.1
PCIE.CLKREQN: CN13.7(CLKnotREQ) Q4.1(G) R91.1 ; port PCIE.CLKREQN
PCIE.NWAKE: CN13.1(WAKEnot) ; port PCIE.NWAKE
PCIE.RSTN: CN13.22(PERSTnot) ; port PCIE.RSTN
PCIE.RX1_N: CN13.23(PERN0) U27.AB20(COMBOPHY_RX1N)
PCIE.RX1_P: CN13.25(PERP0) U27.AA20(COMBOPHY_RX1P)
PCIE.TX1_N: C98.2 CN13.31(PETN0)
PCIE.TX1_P: C97.2 CN13.33(PETP0)
PCIE.USB_N: CN13.36(USB_DM) ; port PCIE.USB_N
PCIE.USB_P: CN13.38(USB_DP) ; port PCIE.USB_P
PCIE_CLKOUT_N: R78.1 U27.AB21(PCIE_CLKOUTN)
PCIE_CLKOUT_P: R77.1 U27.AA21(PCIE_CLKOUTP)
SRC_GDPG: C162.1 Q5.2(G2) Q5.4(G1) R325.2 U50.5(GDPG)
SRC_GDPS: Q5.1(S2) Q5.3(S1) R325.1 U50.6(GDPS)
TCPP_EN: R326.1 ; port TCPP_EN
TCPP_INTN: U50.19(FLGn) ; port TCPP_INTN
UCPD_CC1: TP37.1 U27.T15(UCPD1_CC1) U50.1(CC1)
UCPD_CC2: TP36.1 U27.T17(UCPD1_CC2) U50.3(CC2)
USB_DCONN_N: CN15.A7(D-1) CN15.B7(D-2) U42.2(D-_con)
USB_DCONN_P: CN15.A6(D+1) CN15.B6(D+2) U42.1(D+_con)
USBDR_N: U27.Y17(USB3DR_DM) U42.5(D-_ic)
USBDR_P: U27.W17(USB3DR_DP) U42.6(D+_ic)
USBH_N: U27.AB16(USBH_HS_DM) ; port USBH_N
USBH_P: U27.AA16(USBH_HS_DP) ; port USBH_P
VBUS_DIV: R219.1 R220.2 ; port VBUS_DIV
VBUSc: C156.2 C159.2 CN15.A4(VBUS1) CN15.A9(VBUS2) CN15.B4(VBUS3) CN15.B9(VBUS4) R219.2 R225.1 R232.1 TP39.1 U43.1(IO1) U50.9(VBUSc)
NetC101_2: C101.2 C102.2 R92.2 U33.12(VDD1) U33.13(VDD0)
NetC168_2: C168.2 CN15.A5(CC1) U50.15(CC1c)
NetC170_2: C170.2 U50.14(CBIAS)
NetC171_2: C171.2 CN15.B5(CC2) U50.13(CC2c)
NetCN13_3: CN13.3(COEX1) TP14.1
NetCN13_5: CN13.5(COEX2) TP15.1
NetCN13_8: CN13.8(UIM_PWR) TP16.1
NetCN13_10: CN13.10(UIM_DATA) TP17.1
NetCN13_12: CN13.12(UIM_CLK) TP19.1
NetCN13_14: CN13.14(UIM_RESET) TP18.1
NetCN13_16: CN13.16(UIM_VPP) TP20.1
NetCN13_20: CN13.20(W_notDISABLE) TP21.1
NetCN13_30: CN13.30(SMB_CLK) R290.1
NetCN13_32: CN13.32(SMB_DATA) R291.1
NetCN13_42: CN13.42(LED_notWWLAN) TP23.1
NetCN13_44: CN13.44(LED_notWLAN) LD10.2
NetCN13_45: CN13.45(RSVD3) CN13.47(RSVD4) CN13.49(RSVD5) TP24.1
NetCN13_46: CN13.46(LED_notWPAN) LED2.2
NetCN13_51: CN13.51(RSVD6) TP25.1
NetLD10_1: LD10.1 R172.2
NetLED2_1: LED2.1 R171.1
NetQ4_3: Q4.3(D) U33.1(OE)
NetQ5_7: Q5.7(D2) Q5.8(D2) R225.2 U50.10(ISENSE)
NetR223_1: R223.1 R326.2 R327.2 U50.20(EN)
NetR231_1: R231.1 R232.2 U50.11(VSENSE)
NetR274_1: R274.1 U27.V16(USBH_HS_TXRTUNE)
NetR285_2: R285.2 U27.Y20(COMBOPHY_REXT)
NetR287_1: R287.1 U27.V17(USB3DR_TXRTUNE)
NetTP38_1: TP38.1 U50.4(IANA)

Not connected (* = marked no-connect by the designer): CN13 17(RSVD1)* 19(RSVD2)*; CN15 A2(TX1+)* A3(TX1-)* A8(SBU1)* A10(RX2-)* A11(RX2+)* B2(TX2+)* B3(TX2-)* B8(SBU2)* B10(RX1-)* B11(RX1+)*; U27 U16(DNC)*; U42 3(GND)*; U50 7(GDCG)* 8(GDCS)*

### Layout directives
differential pair: 100MCLK0_N, 100MCLK0_P, 100MCLK1_N, 100MCLK1_P, COMBOTX1_N, COMBOTX1_P, PCIE.CLKIN_N, PCIE.CLKIN_P, PCIE.CLKOUT_N, PCIE.CLKOUT_P, PCIE.RX1_N, PCIE.RX1_P, PCIE.TX1_N, PCIE.TX1_P, PCIE.USB_N, PCIE.USB_P, PCIE_CLKOUT_N, PCIE_CLKOUT_P, USB_DCONN_N, USB_DCONN_P, USBDR_N, USBDR_P, USBH_N, USBH_P

### Notes on the sheet
- PCIe
- MiniPCIe
- (near R83) 49.9R CLK0 close to MP2
- (near U33) External 100Mhz
- AC Cap : close to MP2
- DSC557 OE  -> Internal pull up 40K
- (near LED2) Wifi led
- From  USB HUB
- differentiels CLK/RX/TX :100ohms
- Termination Resistor 49.9R CLK1 close to PCIe connector
- (near LED2) BT led
- To USB HUB
- USB_DRD
- Source/Sink(with sink current=0)
- SOURCE
- Dedicated and differential PCB tracks between R117 and U3 pin 9 and 10
- (near U50) Default I2C Address: 0110101X
- Title:
- Project:
- Size:
- Revision:
- Variant:
- A3
- -
- Date:
- Reference:
- Sheet:
- of
- (in symbol MCD-03232) USB TYPE-C

### Library data of the parts
C97 C98 = MCD-01535: Capacitor, MLCC,100nF, 10V, X7R, +/-10%, 0201, T=0.3mm; Part_Preference: Recommended; Manufacturer: MURATA; Manufacturer_Part_Number: GRM033R61A104KE15; Order_Code_RS: 790-2742; Component_Country_Of_Origin: Japan; ID: 3635; ShowFields: YES; Internal_Part_Number: MCD-01535; Status: Checked; Part_Type: Capacitor; Package: 0201; ComponentLink1URL: http://tunmcdsvn.tun.st.com/Component_Documentation_Library/Trunk/Capacitor/MURATA_GRM_Series; Order_Code_Digikey: 490-5881-1-ND; Order_Code_Farnell: 2470450
C101 C102 C334 = MCD-00006: Capacitor, MLCC, 100nF, 16V, X7R, +/-10%, 0402, T=0.5mm; Part_Preference: Recommended; Manufacturer: YAGEO; Manufacturer_Part_Number: CC0402KRX7R7BB104; Order_Code_RS: 616-9701; Component_Country_Of_Origin: China; ID: 2474; ShowFields: YES; Internal_Part_Number: MCD-00006; Status: Released; Part_Type: Capacitor; Package: 0402; ComponentLink1URL: http://tunmcdsvn.tun.st.com/Component_Documentation_Library/Trunk/Capacitor/YAGEO_X7R_Series; Order_Code_Digikey: 311-1338-1-ND; Order_Code_Farnell: 9402047
C156 = MCD-00205: Capacitor, MLCC, 100pF, 50V, NPO, +/-5%, 0402, T=0.5mm; Manufacturer_Part_Number: CC0402JRNPO9BN101; Manufacturer: YAGEO; Part_Preference: Recommended; Component_Country_Of_Origin: China; ID: 2658; ShowFields: YES; Internal_Part_Number: MCD-00205; Status: Released; Part_Type: Capacitor; Package: 0402; ComponentLink1URL: http://tunmcdsvn.tun.st.com/Component_Documentation_Library/Trunk/Capacitor/YAGEO_NP0_Series; Order_Code_Digikey: 311-1024-1-ND; Order_Code_Farnell: 3019226RL; Order_Code_RS: N/A
C159 = MCD-02372: Capacitor, MLCC, 2.2uF, 25V, X7R, +/-10%, 0805, T=1,25mm; Part_Preference: Recommended; Manufacturer: MURATA; Manufacturer_Part_Number: GRM21BR71E225KE11L; Component_Country_Of_Origin: Japan; ID: 4478; ShowFields: YES; Internal_Part_Number: MCD-02372; Status: Released; Part_Type: Capacitor; Package: 0805; ComponentLink1URL: http://tunmcdsvn.tun.st.com/Component_Documentation_Library/Trunk/Capacitor/MURATA_GRM_Series/GRM21BR71E225KE11; Order_Code_Digikey: 490-14467; Order_Code_Farnell: 2688538; Order_Code_RS: N/A
C162 = MCD-01995: Capacitor, MLCC, 22pF, 50V, C0G, +/-5%, 0402, T=0.5mm; Part_Preference: Recommended; Manufacturer: TDK; Manufacturer_Part_Number: C1005NP01H220J050BA; Component_Country_Of_Origin: Unknown; ID: 4095; ShowFields: YES; Internal_Part_Number: MCD-01995; Status: Released; Part_Type: Capacitor; Package: 0402; ComponentLink1URL: http://tunmcdsvn.tun.st.com/Component_Documentation_Library/Trunk/Capacitor/TDK_C_Series; Order_Code_Digikey: 445-13793-1-ND; Order_Code_Farnell: 3416050RL; Order_Code_RS: N/A
C168 C171 = MCD-00724: Capacitor, MLCC, 470pF, 50V, NPO, +/-5%, 0402, T=0.5mm; Manufacturer_Part_Number: CC0402JRNPO9BN471; Manufacturer: YAGEO; Part_Preference: Recommended; Component_Country_Of_Origin: China; Order_Code_RS: 199-2186; ID: 3023; ShowFields: YES; Internal_Part_Number: MCD-00724; Status: Released; Part_Type: Capacitor; Package: 0402; ComponentLink1URL: http://tunmcdsvn.tun.st.com/Component_Documentation_Library/Trunk/Capacitor/YAGEO_NP0_Series; Order_Code_Digikey: 311-1671-1-ND; Order_Code_Farnell: 3366416
C170 = MCD-01099: Capacitor, MLCC, 100nF, 50V, X7R, +/-10%, 0603, T=0.8mm; BMS_Part_Number: 9142278; Part_Preference: Recommended; Manufacturer: YAGEO; Manufacturer_Part_Number: CC0603KRX7R9BB104; Order_Code_RS: 669-8767; Component_Country_Of_Origin: China; ID: 3397; ShowFields: YES; Internal_Part_Number: MCD-01099; Status: Released; Part_Type: Capacitor; Package: 0603; ComponentLink1URL: http://tunmcdsvn.tun.st.com/Component_Documentation_Library/Trunk/Capacitor/YAGEO_X7R_Series; Order_Code_Digikey: 311-1344-1-ND; Order_Code_Farnell: 1362556
C265-C269 C272 C274 = MCD-00697: Capacitor, MLCC, 100nF,10V, X5R, +/-10%, 0201, T=0.3mm; Manufacturer_Part_Number: C0603X5R1A104K030BC; Manufacturer: TDK; Part_Preference: Recommended; Component_Country_Of_Origin: Unknown; ID: 3046; ShowFields: YES; Internal_Part_Number: MCD-00697; Status: Released; Part_Type: Capacitor; Package: 0201; ComponentLink1URL: http://tunmcdsvn.tun.st.com/Component_Documentation_Library/Trunk/Capacitor/TDK_MCC_Series; Order_Code_Digikey: 445-7318-1-ND; Order_Code_Farnell: 2524957; Order_Code_RS: N/A
C335 = MCD-01356: Capacitor, MLCC, 4.7uF, 6V3, X5R, +/-20%, 0402, T=0.5mm; Part_Preference: Recommended; Manufacturer: MURATA; Manufacturer_Part_Number: GRM155R60J475ME47; Order_Code_RS: 814-5230; Component_Country_Of_Origin: Japan; ID: 3456; ShowFields: YES; Internal_Part_Number: MCD-01356; Status: Released; Part_Type: Capacitor; Package: 0402; ComponentLink1URL: http://tunmcdsvn.tun.st.com/Component_Documentation_Library/Trunk/Capacitor/MURATA_GRM_Series; Order_Code_Digikey: 490-5915-1-ND; Order_Code_Farnell: 2666407
CN13 = MCD-02227: Socket_Mini PCIE, 52 pins, RA, SMD, T=4mm; Part_Type: Connector; Part_Preference: Recommended; Manufacturer: TE CONNECTIVITY; Manufacturer_Part_Number: 2041119-1; Order_Code_RS: 186-5008; Component_Country_Of_Origin: China; ShowFields: YES; ID: 4327; Internal_Part_Number: MCD-02227; Status: Checked; ComponentLink1URL: http://tunmcdsvn.tun.st.com/Component_Documentation_Library/Trunk/Connector/TE_CONNECTIVITY_2041119_Series/; Order_Code_Digikey: A108265TR-ND; Order_Code_Farnell: 3133832
CN15 = MCD-03232: USB_TypeC, 24 pins, RA, SMD, T=2.96mm; Part_Type: Connector; Part_Preference: Recommended; Manufacturer: AMPHENOL ICC; Manufacturer_Part_Number: 12401826E412A; Component_Country_Of_Origin: China°; ShowFields: YES; ID: 5348; Internal_Part_Number: MCD-03232; Status: Released; ComponentLink1URL: http://tunmcdsvn.tun.st.com/Component_Documentation_Library/Trunk/Connector/AMPHEMOL_ICC_12401826E412A; Order_Code_Digikey: 12401826E412ATR-ND; Order_Code_Farnell: 3727763; Order_Code_RS: N/A
HW8 HW9 = MCD-02934: Screw , M2*4 mm; Part_Type: Accessory; Part_Preference: Recommended; Manufacturer: RS PRO; Manufacturer_Part_Number: 914-1462; ShowFields: YES; ID: 5050; Internal_Part_Number: MCD-02934; Status: New; ComponentLink1URL: http://N/A; Order_Code_Digikey: N/A; Order_Code_Farnell: N/A; Order_Code_RS: 914-1462
HW10 HW11 = MCD-03022: MiniPCIe Stand off , 1.6mm; Part_Type: Mechanical; Part_Preference: Recommended; Manufacturer: ATTEND; ShowFields: YES; ID: 5138; Internal_Part_Number: MCD-03022; Status: Checked; Manufacturer_Part_Number: 119A-NUT-40-R02; ComponentLink1URL: http://tunmcdsvn.tun.st.com/Component_Documentation_Library/Trunk/Mechanical/ATTEND_119A-NUT-40-R02; Order_Code_Digikey: N/A; Order_Code_Farnell: N/A; Order_Code_RS: N/A
LD10 = MCD-00588: LED Green, 0603 SMD, Forward Voltage Typ=2V, Max=2.5V; Part_Type: Display; Manufacturer_Part_Number: LG Q396-PS-35; Manufacturer: OSRAM OPTO SEMICONDUCTORS; Alternate_Manufacturer_Part_Number: VLMTG1300-GS08; Alternate_Manufacturer: VISHAY SEMICONDUCTOR OPTO DIVISION; Alternate_Internal_Part_Number: MCD-02400; Part_Preference: Recommended; Provided_By: SUBCO; Component_Country_Of_Origin: Unknown; ID: 3155; ShowFields: YES; Internal_Part_Number: MCD-00588; Status: Released; Package: LED 0603; ComponentLink1Description: Datasheet; ComponentLink1URL: http://tunmcdsvn.tun.st.com/Component_Datasheet_Library/Trunk/Display/OSRAM_LED_GREEN_LG Q396-PS-35; Order_Code_Digikey: LG Q396-PS-35-ND; ECCN_US: n/a; ECCN_EU: n/a
LED2 = MCD-00585: LED Blue, 0603 SMD, Forward Voltage Min=2,8V, Max=3,8V; Part_Type: Display; Manufacturer_Part_Number: LB Q39G-L2OO-35-1; Manufacturer: OSRAM OPTO SEMICONDUCTORS; Alternate_Manufacturer_Part_Number: 19-217-BHC-ZL1M2RY-3T-V4; Alternate_Manufacturer: EVERLIGHT; Alternate_Internal_Part_Number: MCD-02398; Part_Preference: Recommended; Order_Code_RS: 9148643; Provided_By: SUBCO; Component_Country_Of_Origin: Unknown; ID: 3159; ShowFields: YES; Internal_Part_Number: MCD-00585; Status: Released; Package: LED 0603; ComponentLink1Description: Datasheet; ComponentLink1URL: http://tunmcdsvn.tun.st.com/Component_Datasheet_Library/Trunk/Display/OSRAM_LED_BLUE_LB Q39G-L2OO-35-1; Order_Code_Digikey: 475-2816-1-ND; ECCN_US: n/a; ECCN_EU: n/a
Q4 = MCD-02221: MOSFET N-CH 20V SC-89; Part_Preference: Recommended; Part_Type: Transistor; Manufacturer: VISHAY; Order_Code_RS: 812-3044; Component_Country_Of_Origin: Philippines; ID: 4321; ShowFields: YES; Internal_Part_Number: MCD-02221; Status: Checked; Package: SC-89; ComponentLink1URL: http://tunmcdsvn.tun.st.com/Component_Datasheet_Library/Trunk/Transistors/VISHAY_Si1062X; Order_Code_Digikey: SI1062X-T1-GE3CT-ND; Order_Code_Farnell: 2646363
Q5 = MCD-02152: MOSFET, Dual N-channel 30 V, 0.016 Ω typ., 40 A, STripFET™ H5 Power MOSFET; Part_Preference: Recommended; Part_Type: Transistor; Manufacturer: STMICROELECTRONICS; Manufacturer_HQ_COO: EU; Component_Country_Of_Origin: China; ID: 4252; ShowFields: YES; Internal_Part_Number: MCD-02152; Value: STL40DN3LLH5; Status: Released; Manufacturer_Part_Number: STL40DN3LLH5; Package: PowerFLAT 5x6; ComponentLink1URL: http://tunmcdsvn.tun.st.com/Component_Datasheet_Library/Trunk/Transistors/STMICROELECTRONICS_STL40DN3LLH5; Order_Code_Digikey: N/A; Order_Code_Farnell: N/A; Order_Code_RS: N/A
R77 R78 R87-R90 R92 = MCD-00052: Resistor, 0R, 0402, +/-5%, 1/16W; Part_Preference: Recommended; Manufacturer: YAGEO; Manufacturer_Part_Number: RC0402JR-070RL; Order_Code_RS: 618-5804; Component_Country_Of_Origin: China; ID: 2540; ShowFields: YES; Internal_Part_Number: MCD-00052; Status: Released; Part_Type: Resistor; Package: 0402; ComponentLink1URL: http://tunmcdsvn.tun.st.com/Component_Documentation_Library/Trunk/Resistor/YAGEO_RC_L_Series; Order_Code_Digikey: 311-0.0JRCT-ND; Order_Code_Farnell: 9232516RL
R82-R85 = MCD-00565: Resistor, 49R9, 0402, +/-1%, 1/16W; Part_Preference: Recommended; Manufacturer: YAGEO; Manufacturer_Part_Number: RC0402FR-0749R9L; Component_Country_Of_Origin: China; ID: 3178; ShowFields: YES; Internal_Part_Number: MCD-00565; Status: Released; Part_Type: Resistor; Package: 0402; ComponentLink1URL: http://tunmcdsvn.tun.st.com/Component_Documentation_Library/Trunk/Resistor/YAGEO_RC_L_Series; Order_Code_Digikey: 311-49.9LRCT-ND; Order_Code_Farnell: 1799218; Order_Code_RS: N/A
R91 R220 R223 = MCD-00053: Resistor, 10K, 0402, +/-1%, 1/16W; BMS_Part_Number: 9131590; Part_Preference: Recommended; Manufacturer: YAGEO; Manufacturer_Part_Number: RC0402FR-0710KL; Component_Country_Of_Origin: China; ID: 2539; ShowFields: YES; Internal_Part_Number: MCD-00053; Status: Released; Part_Type: Resistor; Package: 0402; ComponentLink1URL: http://tunmcdsvn.tun.st.com/Component_Documentation_Library/Trunk/Resistor/YAGEO_RC_L_Series; Order_Code_Digikey: 311-10.0KLRCT-ND; Order_Code_Farnell: 9239359; Order_Code_RS: N/A
R171 = MCD-00194: Resistor,120R,0402,1%,1/16W; Manufacturer_Part_Number: RC0402FR-07120RL; Manufacturer: YAGEO; Part_Preference: Recommended; Provided_By: SUBCO; ECCN_US: EAR99; ECCN_EU: NEC; Component_Country_Of_Origin: China; ID: 2674; ShowFields: YES; Internal_Part_Number: MCD-00194; Status: Released; Part_Type: Resistor; Package: 0402; ComponentLink1Description: Datasheet; ComponentLink1URL: http://tunmcdsvn.tun.st.com/Component_Documentation_Library/Trunk/Resistor/YAGEO_RC_L_Series; Order_Code_Digikey: 311-120LRCT-ND; Order_Code_Farnell: 9239120; Order_Code_RS: N/A
R172 = MCD-00441: Resistor,270R,0402,1%,1/16W; Manufacturer_Part_Number: RC0402FR-07270RL; Manufacturer: YAGEO; Part_Preference: Recommended; Provided_By: SUBCO; ECCN_US: EAR99; ECCN_EU: NEC; Component_Country_Of_Origin: China; ID: 2838; ShowFields: YES; Internal_Part_Number: MCD-00441; Status: Released; Part_Type: Resistor; Package: 0402; ComponentLink1Description: Datasheet; ComponentLink1URL: http://tunmcdsvn.tun.st.com/Component_Documentation_Library/Trunk/Resistor/YAGEO_RC_L_Series; Order_Code_Digikey: 311-270LRCT-ND; Order_Code_Farnell: 9239162; Order_Code_RS: N/A
R219 = MCD-02335: Resistor, 140K, 0402, +/-1%, 1/16W; Part_Preference: Recommended; Manufacturer: YAGEO; Manufacturer_Part_Number: RC0402FR-07140KL; Component_Country_Of_Origin: China; ID: 4441; ShowFields: YES; Internal_Part_Number: MCD-02335; Status: Checked; Part_Type: Resistor; Package: 0402; ComponentLink1URL: http://tunmcdsvn.tun.st.com/Component_Documentation_Library/Trunk/Resistor/YAGEO_RC_L_Series; Order_Code_Digikey: YAG2978CT-ND; Order_Code_Farnell: N/A; Order_Code_RS: N/A
R225 = MCD-02232: Resistor, 22mR, 0603, +/-1%, 1/3W; Part_Preference: Recommended; Manufacturer: PANASONIC; Manufacturer_Part_Number: ERJ-3BWFR022V; Order_Code_RS: 763-8671P; Component_Country_Of_Origin: Japan; ID: 4332; ShowFields: YES; Internal_Part_Number: MCD-02232; Status: Checked; Part_Type: Resistor; Package: 0603; ComponentLink1URL: http://tunmcdsvn.tun.st.com/Component_Documentation_Library/Trunk/Resistor/PANASONIC_ERJ_Series; Order_Code_Digikey: P17462CT-ND; Order_Code_Farnell: 1798578
R231 = MCD-00435: Resistor, 24K, 0402, +/-1%, 1/16W; Part_Preference: Recommended; Manufacturer: YAGEO; Manufacturer_Part_Number: RC0402FR-0724KL; Component_Country_Of_Origin: China; ShowFields: YES; ID: 2845; Internal_Part_Number: MCD-00435; Status: Released; Part_Type: Resistor; Package: 0402; ComponentLink1URL: http://tunmcdsvn.tun.st.com/Component_Documentation_Library/Trunk/Resistor/YAGEO_RC_L_Series; Order_Code_Digikey: 311-24KLRCT-ND; Order_Code_Farnell: N/A; Order_Code_RS: N/A
R232 R327 = MCD-02265: Resistor,100K,0402,0.5%,1/16W; Part_Preference: Recommended; Manufacturer: YAGEO; Manufacturer_Part_Number: RC0402DR-07100KL; Component_Country_Of_Origin: China; ShowFields: YES; ID: 4365; Internal_Part_Number: MCD-02265; Status: Released; Part_Type: Resistor; Package: 0402; ComponentLink1URL: http://tunmcdsvn.tun.st.com/Component_Datasheet_Library/Trunk/Resistors/Yageo_Resistor_RC0402-series; Order_Code_Digikey: 13-RC0402DR-07100KLTR-ND; Order_Code_Farnell: N/A; Order_Code_RS: N/A
R274 R285 R287 = MCD-00417: Resistor, 200R, 0402, +/-1%, 1/16W; Part_Preference: Recommended; Manufacturer: YAGEO; Manufacturer_Part_Number: RC0402FR-07200RL; Component_Country_Of_Origin: China; ID: 2860; ShowFields: YES; Internal_Part_Number: MCD-00417; Status: Released; Part_Type: Resistor; Package: 0402; ComponentLink1URL: http://tunmcdsvn.tun.st.com/Component_Documentation_Library/Trunk/Resistor/YAGEO_RC_L_Series; Order_Code_Digikey: 311-200LRCT-ND; Order_Code_Farnell: 1458756; Order_Code_RS: N/A
R288 R328 = MCD-00052: Resistor,0R,0402,5%,1/16W; Part_Preference: Recommended; Manufacturer: YAGEO; Manufacturer_Part_Number: RC0402JR-070RL; Order_Code_RS: 618-5804; Internal_Part_Number: MCD-00052; Status: Released; Part_Type: Resistor; Package: 0402; ComponentLink1Description: Datasheet; ComponentLink1URL: http://tunmcdsvn.tun.st.com/Component_Documentation_Library/Trunk/Resistor/YAGEO_RC_L_Series; Order_Code_Digikey: 311-0.0JRCT-ND; Order_Code_Farnell: 9232516RL; Alternate_Manufacturer: N/A; Alternate_Manufacturer_Part_Number: N/A
R290 R291 = MCD-00052: Resistor, 0R, 0402, +/-5%, 1/16W; Part_Preference: Recommended; Manufacturer: YAGEO; Manufacturer_Part_Number: RC0402JR-070RL; Order_Code_RS: 618-5804; Component_Country_Of_Origin: China; ShowFields: YES; ID: 2540; Internal_Part_Number: MCD-00052; Status: Released; Part_Type: Resistor; Package: 0402; ComponentLink1URL: http://tunmcdsvn.tun.st.com/Component_Documentation_Library/Trunk/Resistor/YAGEO_RC_L_Series; Order_Code_Digikey: 311-0.0JRCT-ND; Order_Code_Farnell: 9232516RL
R325 = MCD-00182: Resistor, 1M, 0402, +/-1%, 1/16W; BMS_Part_Number: 9131778; Part_Preference: Recommended; Manufacturer: YAGEO; Manufacturer_Part_Number: RC0402FR-071ML; Order_Code_RS: 618-6194; Component_Country_Of_Origin: China; ShowFields: YES; ID: 2686; Internal_Part_Number: MCD-00182; Status: Released; Part_Type: Resistor; Package: 0402; ComponentLink1URL: http://tunmcdsvn.tun.st.com/Component_Documentation_Library/Trunk/Resistor/YAGEO_RC_L_Series; Order_Code_Digikey: 311-1.00MLRCT-ND; Order_Code_Farnell: 9239588
R326 = MCD-00052: Resistor,0R,0402,5%,1/16W; Manufacturer_Part_Number: RC0402JR-070RL; Manufacturer: YAGEO; Part_Preference: Recommended; Order_Code_RS: 618-5804; Component_Country_Of_Origin: China; ID: 2540; ShowFields: YES; Internal_Part_Number: MCD-00052; Status: Released; Part_Type: Resistor; ComponentLink1Description: Part_Information; ComponentLink1URL: http://tunmcdsvn.tun.st.com/Component_Documentation_Library/Trunk/Resistor/YAGEO_RC_L_Series; Package: 0402; Order_Code_Digikey: 311-0.0JRCT-ND; Order_Code_Farnell: 9232516RL; Alternate_Manufacturer: N/A; Alternate_Manufacturer_Part_Number: N/A
TP14-TP21 TP23-TP25 TP34 TP36-TP39 = MCD-00074: Test Point 1mm; Part_Type: Misc; Part_Preference: Recommended; ID: 2518; ShowFields: YES; Internal_Part_Number: MCD-00074; Status: Released; Manufacturer_Part_Number: n/a; ComponentLink1URL: http://na; Order_Code_Digikey: N/A; Order_Code_Farnell: N/A; Order_Code_RS: N/A
  TP14-TP21 TP23-TP25: Manufacturer: n/a
  TP34 TP36-TP39: Manufacturer: N/A
U27 = MCD-02000: MPU, ARM Cortex-A35 + M33 32-bit MPU, 808KB RAM, With Crypto; Part_Type: IC; Part_Preference: Recommended; Manufacturer: STMICROELECTRONICS; Manufacturer_HQ_COO: EU; Component_Country_Of_Origin: Unknown; ShowFields: YES; ID: 4100; Internal_Part_Number: MCD-02000; Value: STM32MP257FAI3; Status: Checked; Manufacturer_Part_Number: STM32MP257FAI3; Package: LFBGA-436; ComponentLink1URL: http://tunmcdsvn.tun.st.com/Component_Documentation_Library/Trunk/IC/STMICROELECTRONICS_STM32MP257FAI3; Order_Code_Digikey: N/A; Order_Code_Farnell: N/A; Order_Code_RS: N/A
U33 = MCD-02349: Crystal-less Two Output PCIe Gen1/2/3 Clock Generator 100Mhz , 2.25V to 3.6V, 100ppm; Part_Type: IC; Part_Preference: Recommended; Manufacturer: MICROCHIP; Component_Country_Of_Origin: Unknown; ID: 4455; ShowFields: YES; ComponentLink1Description: Datasheet; ComponentLink1URL: http://tunmcdsvn.tun.st.com/Component_Documentation_Library/Trunk/IC/MICROCHIP_DSC557-0344FI0-T/; Internal_Part_Number: MCD-02349; Value: DSC557-0344FI0-T; Status: Checked; Manufacturer_Part_Number: DSC557-0344FI0-T; Package: 14 QFN; Order_Code_Digikey: DSC557-0344FI0TTR-ND; Order_Code_Farnell: N/A; Order_Code_RS: N/A
U42 = MCD-03060: ESD protection & Common Filter High Speed serial Interfaces , 0.4 pitch; Part_Type: IC; Part_Preference: Recommended; Manufacturer: STMICROELECTRONICS; ShowFields: YES; ID: 5176; Component_Country_Of_Origin: China; ComponentLink1Description: Datasheet; ComponentLink1URL: http://tunmcdsvn.tun.st.com/Component_Documentation_Library/Trunk/IC/STMICROELECTRONICS_ECMF4-40A100N10; Internal_Part_Number: MCD-03060; Value: ECMF2-40A100N6; Status: Checked; Manufacturer_Part_Number: ECMF2-40A100N6; Package: uQFN-6; Order_Code_Digikey: 497-ECMF2-40A100N6; Order_Code_Farnell: 3993603; Order_Code_RS: N/A
U43 = MCD-01207: High power Transient voltage suppressor:25V/35A EOS and ESD transients protection.; BMS_Part_Number: 9179045; Part_Type: Diode; Part_Preference: Recommended; Manufacturer: STMICROELECTRONICS; Manufacturer_HQ_COO: EU; Component_Country_Of_Origin: China; ID: 3289; ShowFields: YES; Internal_Part_Number: MCD-01207; Status: Released; Manufacturer_Part_Number: ESDA25P35-1U1M; Package: QFN1610; ComponentLink1URL: http://tunmcdsvn.tun.st.com/Component_Datasheet_Library/Trunk/Diodes/STM_ESD_ESDA25P35-1U1M
U50 = MCD-02130: USB Type-C Port Protection for USB DRP Power Delivery, PPS compliant; Part_Preference: Recommended; Part_Type: IC; Manufacturer: STMICROELECTRONICS; Manufacturer_HQ_COO: EU; Component_Country_Of_Origin: Unknown; ID: 4230; ShowFields: YES; Internal_Part_Number: MCD-02130; Value: TCPP03-M20; Status: Released; Manufacturer_Part_Number: TCPP03-M20; Package: QFN-20L; ComponentLink1URL: http://tunmcdsvn.tun.st.com/Component_Documentation_Library/Trunk/IC/STMICROELECTRONICS_TCPP03-M20; Order_Code_Digikey: N/A; Order_Code_Farnell: N/A; Order_Code_RS: N/A